# Altium schematic sheet Voltage Divider.SchDoc
size A; SheetNumber: 5; SheetTotal: 5
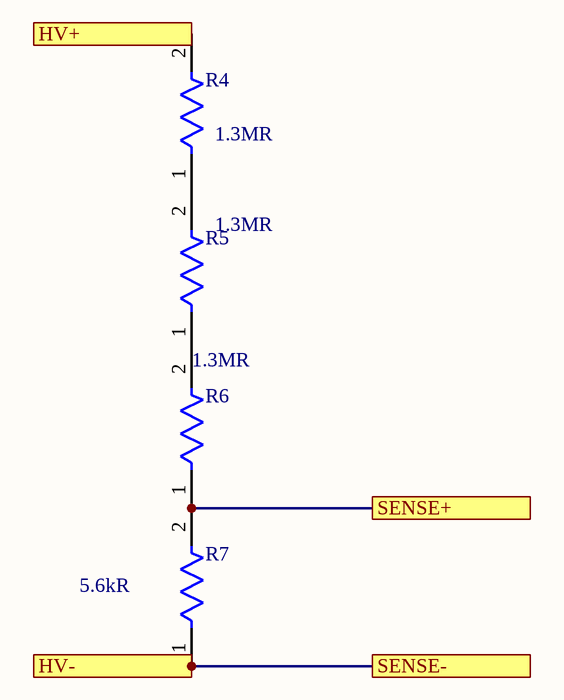
[diagram p0: Voltage Divider.SchDoc]

## Parts
R4  Resistance: 1.3MR  [FP-KTR10-MFG]  (hidden comment: KTR10EZPJ135)
R5  Resistance: 1.3MR  [FP-KTR10-MFG]  (hidden comment: KTR10EZPJ135)
R6  Resistance: 1.3MR  [FP-KTR10-MFG]  (hidden comment: KTR10EZPJ135)
R7  Resistance: 5.6kR  [FP-CRCW0603-e3-MFG]  (hidden comment: CRCW06035K60FKEA)

## Ports
HV+, HV-, SENSE+, SENSE-

## Nets
HV+: R4.2 ; port HV+
HV-: R7.1 ; port HV-, port SENSE-
SENSE+: R6.1 R7.2 ; port SENSE+
NetR4_1: R4.1 R5.2
NetR5_1: R5.1 R6.2

## Library data of the parts
R4-R6 = CMP-08839-031194-1: Res Thick Film 0805 1.3MΩ 5% 0.125W ±200ppm/°C Automotive Paper T/R; Max Power Dissipation: 125mW; Min Operating Temperature: -55°C; Tolerance: 5%; Max Operating Temperature: 155°C; Packaging: Tape and Reel; Resistor Type: Thick Film; Number of Terminations: 2; Length: 0.079inch; Height: 0.026inch; RoHS Compliant: Yes; Temperature Coefficient: 200ppm/°C; Width: 0.049inch; Series: KTR10; Case/Package: 0805; Package Quantity: 5000
R7 = CMP-2000-03487-2: RES Thick Film, 5.6kΩ, 1%, 0.1W, 100ppm/°C, 0603; Voltage Rating: 75V; Power Rating: 100mW; Packaging: Tape and Reel; Case/Package: 0603; Depth: 0.85mm; Package Quantity: 5000; Working Voltage: 75V; Case Code (Metric): 1608; Height: 0.45mm; Voltage Rating (DC): 75V; Tolerance: 1%; Number of Pins: 2; Weight: 7.1E-05oz; Composition: Thick Film; Width: 0.85mm; Temperature Coefficient: 100ppm/°C; Min Operating Temperature: -55°C; Radiation Hardening: No; Contact Plating: Tin; Case Code (Imperial): 0603; Max Operating Temperature: 155°C; Mount: Surface Mount; Length: 1.55mm; Lead Free: Lead Free; Military Standard: Not; Number of Terminations: 2; Termination: SMD/SMT